# Altium project SAMC21N_Xplained_Pro.PrjPCB (part 2 of 3)

## Sheet SAMC21N_Xplained_Pro_dual_input_power_supply.SchDoc: Power supply
size A3; Organization: Microchip India; DocumentNumber: A09-2682; Revision: 4; SheetNumber: 2; SheetTotal: 9; CheckedBy: M.S.K; DrawnBy: Microchip India; PageSetup: Record=PageOptions|CenterHorizontal=True|CenterVertical=True|PrintScale=0.71|XCorrection=1.00|YCorrection=1.00|PrintKind=0|BorderSize=5000000|LeftOffset=0|BottomOffset=0|Orientation=2|PaperLength=1000|PaperWidth=1000|Scale=100|PaperSource=15|PrintQuality=600|MediaType=1|DitherType=10|PrintScaleMode=1|PaperKind=A4 (210 x 297 mm)|PaperIndex=9; PCBNumber: A08-2581; PCBRevision: 2; ProjectTitle: ATSAMC21N-XPRO
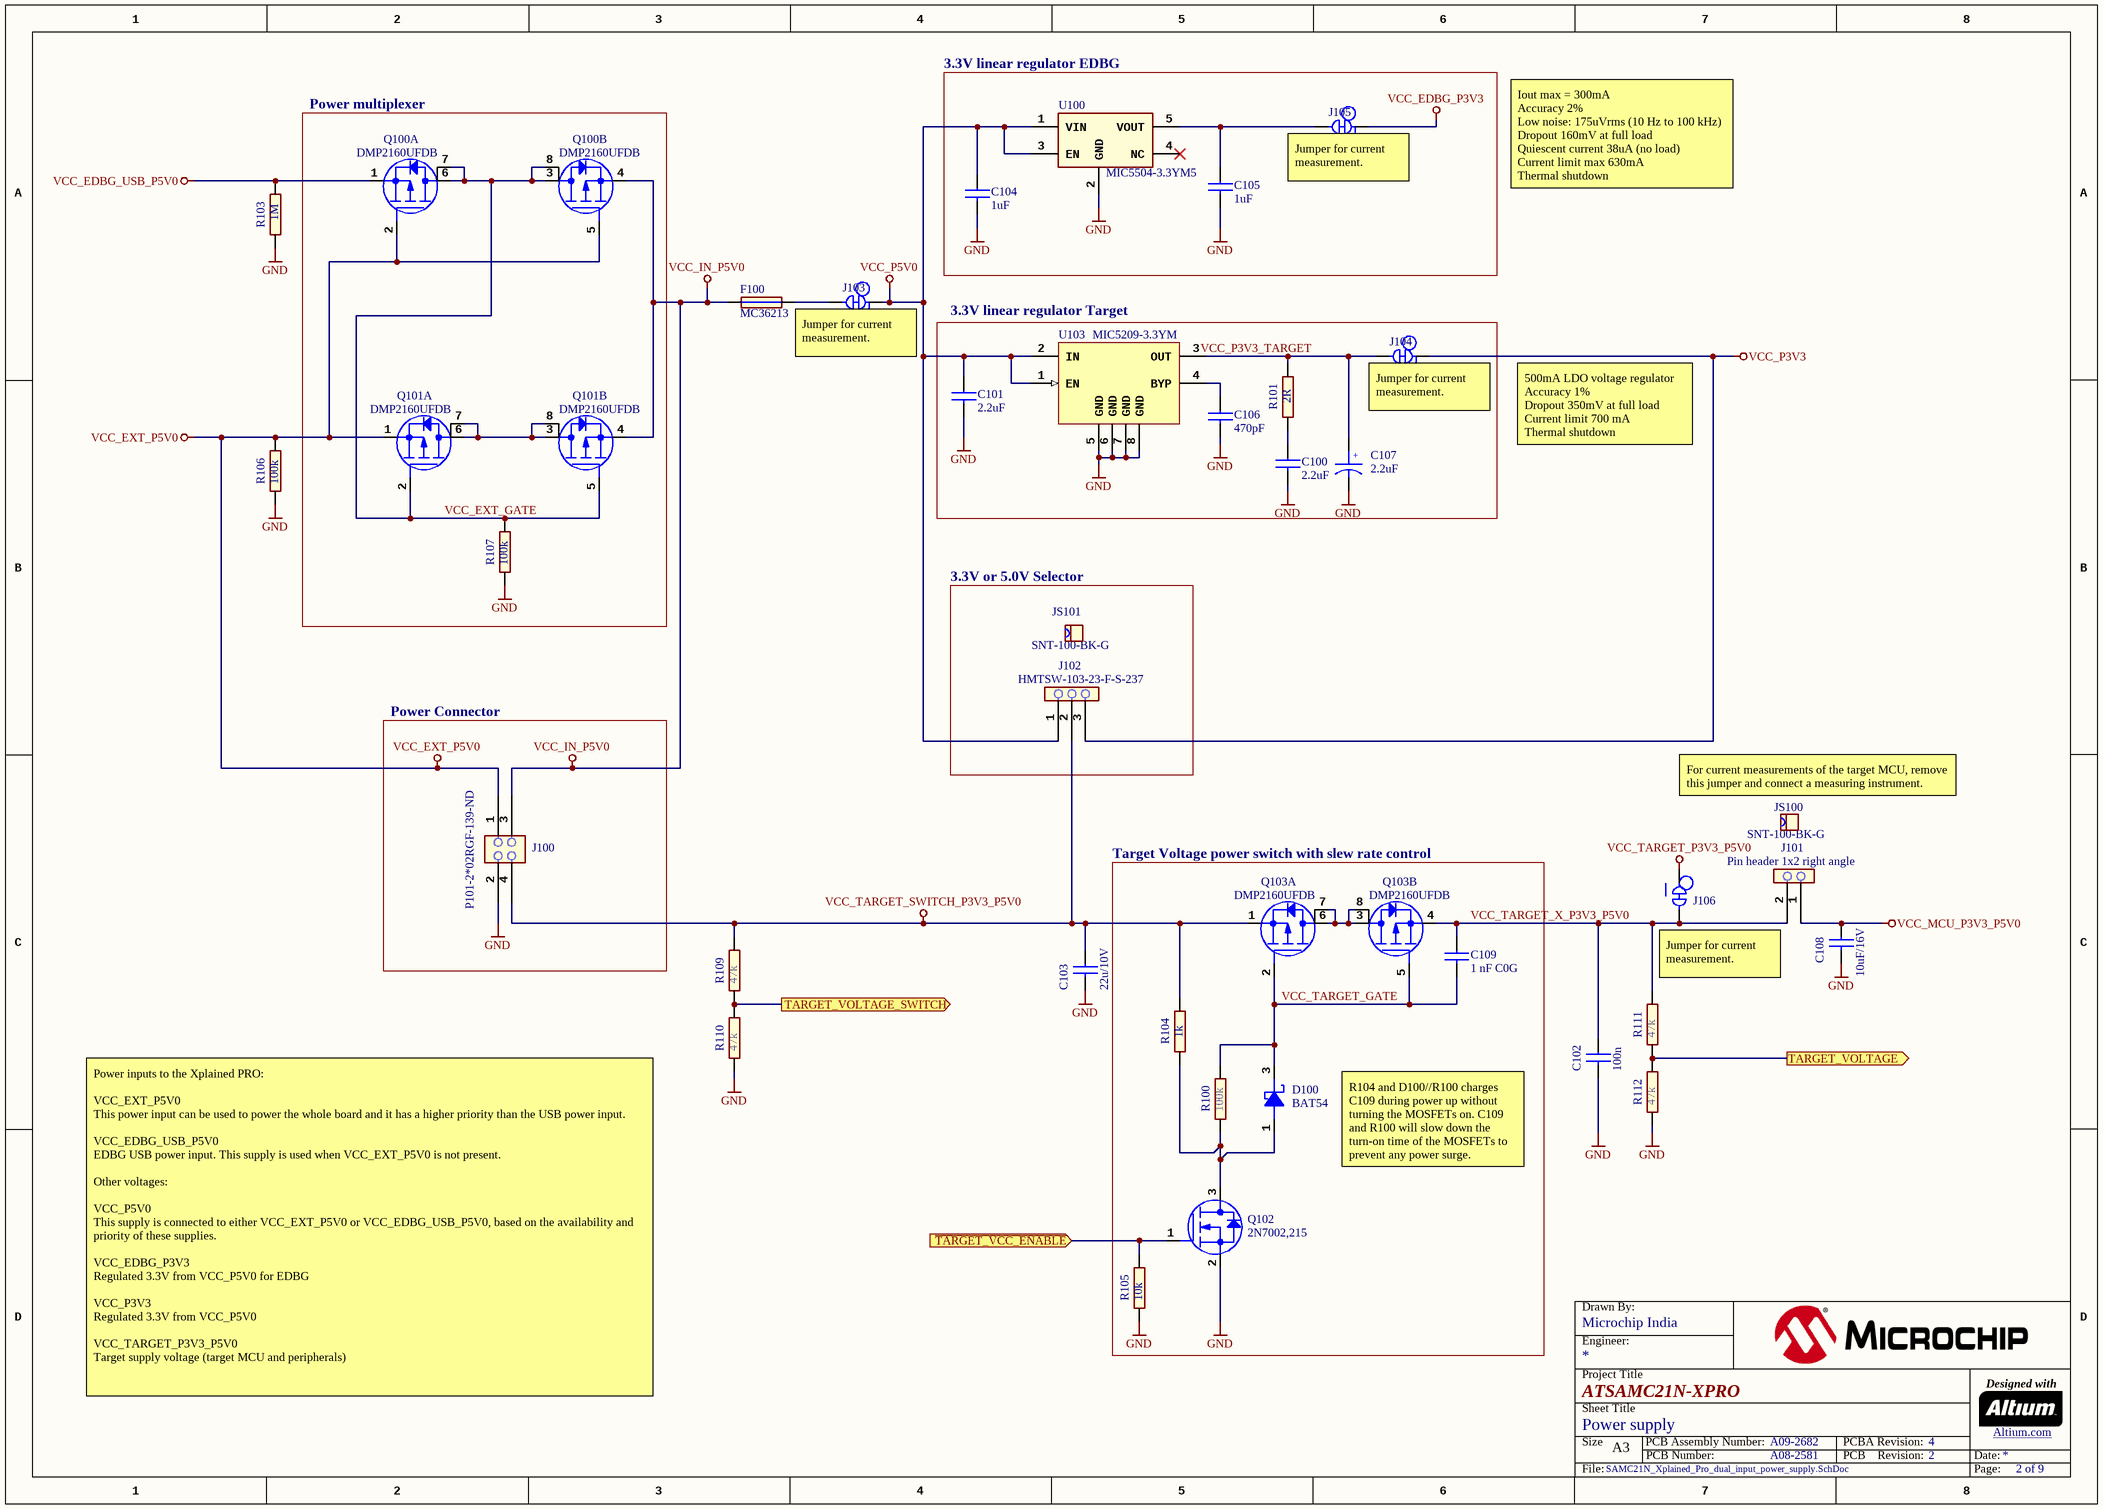
[diagram p4: SAMC21N_Xplained_Pro_dual_input_power_supply.SchDoc]

### Parts
C100  value 2.2uF  [AP1-00096]  (hidden comment: CAP-NONPOL)
C101  value 2.2uF  [AP1-00096]  (hidden comment: CAP-NONPOL)
C102  value 100n  [AP1-00001]  (hidden comment: CAP-NONPOL)
C103  value 22u/10V  [AP1-00003]  (hidden comment: CAP-NONPOL)
C104  value 1uF  [AP1-00001]  (hidden comment: 490-3890-2-ND@digikey)
C105  value 1uF  [AP1-00001]  (hidden comment: 490-3890-2-ND@digikey)
C106  value 470pF  [AP1-00001]  (hidden comment: CAP-NONPOL)
C107  value 2.2uF  [AP1-00036]  (hidden comment: CAP-POL)
C108  value 10uF/16V  [AP1-00039]  (hidden comment: CAP-NONPOL)
C109  1 nF C0G  [AP1-00053]
D100  value BAT54  [AP4-00007]  (hidden comment: SCHOTTKY_SMD_31)
F100  value MC36213  [AP2-00002]  (hidden comment: Farnell no: 1861197)
J100  value P101-2*02RGF-139-ND  [AP8-00628]  (hidden comment: HEADER 2x2)
J101  value Pin header 1x2 right angle  [AP8-00367]  (hidden comment: HEADER 1x2)
J102  value HMTSW-103-23-F-S-237  [AP8-00745]  (hidden comment: Same as A08-1614 but with 1mm hole for optimal reflow soldering (no misalignment of the component))
J103  SMD-STRAP_CLOSED  [AP9-00044]  (value not drawn)  (net tie, no BOM)
J104  SMD-STRAP_CLOSED  [AP9-00044]  (value not drawn)  (net tie, no BOM)
J105  SMD-STRAP_CLOSED  [AP9-00044]  (value not drawn)  (net tie, no BOM)
J106  SMD-STRAP_CLOSED  [AP9-00044]  (value not drawn)  (net tie, no BOM)
JS100  value SNT-100-BK-G  [AP8-00525]  (hidden comment: To be used by request from ESCATEC)
JS101  value SNT-100-BK-G  [AP8-00525]  (hidden comment: To be used by request from ESCATEC)
Q100  value DMP2160UFDB  [AP5-00047]  (hidden comment: MOSFET_DUAL_P_S1G1D2S2G2D1D1D2)  (parts A,B of 2)
Q101  value DMP2160UFDB  [AP5-00047]  (hidden comment: MOSFET_DUAL_P_S1G1D2S2G2D1D1D2)  (parts A,B of 2)
Q102  value 2N7002,215  [AP5-00002]  (hidden comment: MOSFET_N_GSD)
Q103  value DMP2160UFDB  [AP5-00047]  (hidden comment: MOSFET_DUAL_P_S1G1D2S2G2D1D1D2)  (parts A,B of 2)
R100  value 100k  [AP2-00000]  (hidden comment: R2)
R101  value 2R  [AP2-00000]  (hidden comment: R2)
R103  value 1M  [AP2-00000]  (hidden comment: R2)
R104  value 1k  [AP2-00000]  (hidden comment: R2)
R105  value 10k  [AP2-00000]  (hidden comment: R2)
R106  value 100k  [AP2-00000]  (hidden comment: R2)
R107  value 100k  [AP2-00000]  (hidden comment: R2)
R109  value 47k  [AP2-00000]  (hidden comment: R2)
R110  value 47k  [AP2-00000]  (hidden comment: R2)
R111  value 47k  [AP2-00000]  (hidden comment: R2)
R112  value 47k  [AP2-00000]  (hidden comment: R2)
U100  value MIC5504-3.3YM5  [AP6-00087]  (hidden comment: MIC5504)
U103  MIC5209-3.3YM  [AP6-00000]

### Blocks framed on the sheet
Power multiplexer: Q100 Q101 R107
3.3V linear regulator EDBG: C104 C105 J105 U100
3.3V linear regulator Target: C100 C101 C106 C107 J104 R101 U103
3.3V or 5.0V Selector: J102 JS101
Power Connector: J100
Target Voltage power switch with slew rate control: C109 D100 Q102 Q103 R100 R104 R105

### Ports
TARGET_VOLTAGE (out), TARGET_VOLTAGE_SWITCH (out), ~{TARGET_VCC_ENABLE} (in)

### Nets
GND: C100.2 C101.2 C102.2 C103.2 C104.2 C105.2 C106.2 C107.2 C108.2 J100.2 Q102.2(S) R103.1 R105.1 R106.1 R107.1 R110.1 R112.1 U100.2(GND) U103.5(GND) U103.6(GND) U103.7(GND) U103.8(GND)
VCC_EDBG_P3V3: J105.1
VCC_EDBG_USB_P5V0: Q100.1(S1) R103.2
VCC_EXT_P5V0: J100.1 Q100.2(G1) Q100.5(G2) Q101.1(S1) R106.2
VCC_IN_P5V0: F100.1 J100.3 Q100.4(S2) Q101.4(S2)
VCC_MCU_P3V3_P5V0: C108.1 J101.1
VCC_P3V3: J102.3 J104.1
VCC_P5V0: C101.1 C104.1 J102.1 J103.1 U100.1(VIN) U100.3(EN) U103.1(EN) U103.2(IN)
VCC_TARGET_P3V3_P5V0: J106.1
VCC_TARGET_SWITCH_P3V3_P5V0: C103.1 J100.4 J102.2 Q103.1(S1) R104.2 R109.2
EDBG_ADC0: R111.1 R112.2 ; port TARGET_VOLTAGE
EDBG_ADC1: R109.1 R110.2 ; port TARGET_VOLTAGE_SWITCH
~{TARGET_VCC_ENABLE}: Q102.1(G) R105.2 ; port ~{TARGET_VCC_ENABLE}
VCC_EXT_GATE: Q100.3(D2) Q100.6(D1) Q100.7(D1_PAD) Q100.8(D2_PAD) Q101.2(G1) Q101.5(G2) R107.2
VCC_TARGET_GATE: C109.2 D100.3(CATHODE) Q103.2(G1) Q103.5(G2) R100.2
VCC_TARGET_X_P3V3_P5V0: C102.1 C109.1 J101.2 J106.2 Q103.4(S2) R111.2
NetC100_1: C100.1 R101.1
NetC105_1: C105.1 J105.2 U100.5(VOUT)
NetC106_1: C106.1 U103.4(BYP)
NetC107_1: C107.1 J104.2 R101.2 U103.3(OUT)
NetD100_1: D100.1(ANODE) Q102.3(D) R100.1 R104.1
NetF100_2: F100.2 J103.2
NetQ101_3: Q101.3(D2) Q101.6(D1) Q101.7(D1_PAD) Q101.8(D2_PAD)
NetQ103_3: Q103.3(D2) Q103.6(D1) Q103.7(D1_PAD) Q103.8(D2_PAD)

Not connected (* = marked no-connect by the designer): U100 4(NC)*

### Notes on the sheet
- (near J105) Jumper for current measurement.
- Iout max = 300mA
  Accuracy 2%
  Low noise: 175uVrms (10 Hz to 100 kHz)
  Dropout 160mV at full load
  Quiescent current 38uA (no load)
  Current limit max 630mA
  Thermal shutdown
- (near J103) Jumper for current measurement.
- (near J104) Jumper for current measurement.
- 500mA LDO voltage regulator
  Accuracy 1%
  Dropout 350mV at full load
  Current limit 700 mA
  Thermal shutdown
- (near JS100) For current measurements of the target MCU, remove this jumper and connect a measuring instrument.
- Jumper for current measurement.
- R104 and D100//R100 charges C109 during power up without turning the MOSFETs on. C109 and R100 will slow down the turn-on time of the MOSFETs to prevent any power surge.
- Power inputs to the Xplained PRO:
  VCC_EXT_P5V0
  This power input can be used to power the whole board and it has a higher priority than the USB power input.
  VCC_EDBG_USB_P5V0
  EDBG USB power input. This supply is used when VCC_EXT_P5V0 is not present.
  Other voltages:
  VCC_P5V0
  This supply is connected to either VCC_EXT_P5V0 or VCC_EDBG_USB_P5V0, based on the availability and priority of these supplies.
  VCC_EDBG_P3V3
  Regulated 3.3V from VCC_P5V0 for EDBG
  VCC_P3V3
  Regulated 3.3V from VCC_P5V0
  VCC_TARGET_P3V3_P5V0
  Target supply voltage (target MCU and peripherals)
- Labels drawn without touching a wire or pin: VCC_P3V3_TARGET
- Drawn By:
- Project Title
- Engineer:
- Designed with
- Sheet Title
- Size
- A3
- PCB Number:
- PCB Assembly Number:
- PCBA Revision:
- PCB    Revision:
- Date:
- Altium.com <http://go.altium.com/MicrochipLandingPage_Evaluation.html>
- File:
- Page:
- (in symbol A01-0492) +

### Library data of the parts
C100 C101 = A01-0691: Ceramic capacitor, SMD 0603, X7R, 10V, 10%; PartGroup: Capacitors,Ceramic,SMD 0603; Manufacturer: Murata; MPN: GRM188R71A225KE15D; TemperatureRange: -55 to +125 deg C; ComponentStatus: 'Active (verified)'; Status: Active; Verified by: Lars Helge Mo; Verified date: 2005-12-15; AN: A01-0691; Tolerance: 10%; Height: 0.800000011920929; FootprintStatus: 'Active (Verified)'
C102 = A01-0246: Ceramic capacitor, SMD 0402, X7R, 16V, +/-10%; PartGroup: Capacitors,Ceramic,SMD 0402; Manufacturer: Kemet; MPN: C0402C104K4RACTU; TemperatureRange: -55 - +125 deg C; ComponentStatus: 'Active (verified)'; Status: Active; Verified by: Lars Helge Mo; Verified date: 2005-12-15; AN: A01-0246; Tolerance: 16V, +/-10%; Height: 0,5; FootprintStatus: 'Active (Verified)'
C103 = A01-0500: Ceramic capacitor, SMD 0805, X5R, 10V, Â±20%; PartGroup: Capacitors,Ceramic,SMD 0805; Manufacturer: tdk; MPN: C2012X5R1A226M/0.85; TemperatureRange: -55Â°C to +85Â°C; ComponentStatus: 'Active (verified)'; Status: Active; Verified by: Lars Helge Mo; Verified date: 2005-12-15; AN: A01-0500; Height: 0.949999988079071; FootprintStatus: 'Active (Verified)'
C104 C105 = A01-0618: Ceramic capacitor, SMD 0402, X5R, 10V, 10%; PartGroup: Capacitors,Ceramic,SMD 0402; Manufacturer: Murata; MPN: GRM155R61A105KE15D; TemperatureRange: -55 to +85 deg C; ComponentStatus: 'Active (verified)'; Status: Active; Verified by: Lars Helge Mo; Verified date: 2005-12-15; AN: A01-0618; Tolerance: 10%; Height: 0.550000011920929; FootprintStatus: 'Active (Verified)'
C106 = A01-0322: Ceramic capacitor, SMD 0402, NP0, 50V, +/-5%; PartGroup: Capacitors,Ceramic,SMD 0402; Manufacturer: Murata; MPN: GRM1555C1H471JA01D; TemperatureRange: -55 - +125 deg C; ComponentStatus: 'Active (verified)'; Status: Active; Verified by: Lars Helge Mo; Verified date: 2005-12-15; AN: A01-0322; Tolerance: 50V, +/-5%; Height: 0.5; FootprintStatus: 'Active (Verified)'
C107 = A01-0492: Capacitor Tantalum 10V 2.2uF 10% ESR = 6 ohm; PartGroup: Capacitors,Tantalum; Manufacturer: Kemet; MPN: T494A225K010AT; TemperatureRange: - 55 C to + 125 C; ComponentStatus: 'Active (verified)'; Status: Active; Verified date: 2006-02-03; Verified by: Ketil Skjerve; AN: A01-0492; Tolerance: ±10%; Height: 1.79999995231628; FootprintStatus: 'Active (Verified)'
C108 = A01-0491: Ceramic capacitor, SMD 0603, X5R, 16V, 10UF ± 20% (High Density); PartGroup: Capacitors,Ceramic,SMD 0603; Manufacturer: Taiyo Yuden; MPN: EMK107BBJ106MA-T; Tolerance: ­± 20%; TemperatureRange: -55°C to +85°C; ComponentStatus: 'Active (verified)'; Status: Active; Verified by: Lars Helge Mo; Verified date: 2005-12-15; AN: A01-0491; Height: 0,819999992847443; FootprintStatus: 'Active (Verified)'
C109 = A01-0321: Ceramic capacitor, SMD 0402, C0G, 50V, +/-5%; PartGroup: Capacitors,Ceramic,SMD 0402; Manufacturer: Murata; MPN: GRM1555C1H102JA01D; Tolerance: 5%; ComponentStatus: 'Active (verified)'; Status: Active; Verified by: Lars Helge Mo; Verified date: 2005-12-15; AN: A01-0321; Value: 1 nF C0G; FootprintStatus: 'Active (Verified)'
D100 = A04-0001: Schottky diode, V(rrm)=30V, I(f)=0.1A, V(f)=0.4V (at If = 0.01A), I(r)=0.5uA (at Vrrm), t(rr)=5ns, SMD SOT23; PartGroup: Diodes,Schottky; Manufacturer: Philips; NC: 2; TemperatureRange: -40 - +85 deg C; ComponentStatus: 'Active (verified)'; Status: Active; Verified by: Ketil Skjerve; Verified date: 2006-06-28; AN: A04-0001; Height: 1,10000002384186; MPN: BAT54; FootprintStatus: 'Active (Verified)'
F100 = A02-0622: Resetable PTC fuse, Ih = 0.5A, It = 1.0A, 0805 package; PartGroup: Resistors,Resettable fuses,SMD; Manufacturer: Multicomp; TemperatureRange: -40°C to + 85°C; ComponentStatus: 'Active (verified)'; Verified date: 2006-01-30; Verified by: Ketil Skjerve; Status: Active; AN: A02-0622; Height: 1.25; MPN: MC36213; FootprintStatus: 'Active (Verified)'
J100 = A08-1519: Pin header, 2x2, Right Angle, 2.54mm, THT, Pin In Paste; PartGroup: Mechanical devices,Connectors,Pin headers; ComponentStatus: 'New (not verified)'; Verified date: 2005-12-19; Verified by: Lars Helge Mo; Status: Active; AN: A08-1519; Height: 5.07999992370605; MPN: P101-2*02RGF-139-ND; FootprintStatus: 'New (Not verified)'
J101 = A08-0764: 1x2 pin header, right angle, 2.54 mm pitch, through-hole; PartGroup: Mechanical devices,Connectors,Pin headers; Manufacturer: Pro-data International Corp; MPN: 2213R-2G; ComponentStatus: 'Active (verified)'; Verified date: 2006-01-30; Verified by: Lars Helge; Status: Active; AN: A08-0764; Height: 2.53999996185303; FootprintStatus: 'Active (Verified)'
J102 = A08-1799: 1x3 pin header, 2.54mm pitch, Pin-in-Paste THM, 1mm hole; PartGroup: Mechanical devices,Connectors,Pin headers; Manufacturer: SAMTEC; ComponentStatus: 'Active (verified)'; Verified date: 2006-01-30; Verified by: Lars Helge Mo; Status: Active; AN: A08-1799; Height: 6.09999990463257; MPN: HMTSW-103-23-F-S-237; FootprintStatus: 'New (Not verified)'
J103-J106 = A09-0783: Default closed SMD strap, 0603 size; PartGroup: Mechanical devices,PCB implemented components; Value: SMD-STRAP_0603_CLOSED; ComponentStatus: 'Active (verified)'; AN: A09-0783; Height: 0; FootprintStatus: 'Active (Verified)'
JS100 JS101 = A08-0543: Jumper cap for 2.54mm pinheader; PartGroup: Mechanical devices,Mounting accessories,Other; Manufacturer: SAMTEC; ComponentStatus: 'Active (verified)'; Verified date: 2006-04-05; Verified by: Lars Helge Mo; Status: Active; AN: A08-0543; MPN: SNT-100-BK-G; FootprintStatus: 'Active (Verified)'
Q100 Q101 Q103 = A05-0171: MOSFET 20V 3.8A DUAL P-CHAN, Rds 70 mOhms, Vgs 12V, Vds -20; PartGroup: Transistors,Power FET,SMD; Manufacturer: Diodes Incorporated; MPN: DMP2160UFDB-7; TemperatureRange: -55 C to +150 C; ComponentStatus: 'Active (verified)'; AN: A05-0171; Height: 0.605000019073486; FootprintStatus: 'Active (Verified)'
Q102 = A05-0085: N-Channel MOSFET. 60V, 0.300A continuous, 1.2A Peak. RDS(ON) = 3.8Ohm@VGS=4.5V, VGS(th)<2.5V; PartGroup: Transistors,Small signal FET,SMD; Manufacturer: NXP; TemperatureRange: -65 to 150 deg C; ComponentStatus: 'Active (verified)'; Status: New; AN: A05-0085; Height: 1.10000002384186; MPN: 2N7002,215; FootprintStatus: 'Active (Verified)'
R100 = A02-0260: Thick film resistor, SMD 0402, 1/16W, 1%; PartGroup: Resistors,SMD,0402 1%; TemperatureRange: -55ï¿½ to +125ï¿½C; ComponentStatus: 'Active (verified)'; Status: Active; Verified by: Lars Helge Mo; Verified date: 2005-12-19; AN: A02-0260; Tolerance: 1 %; Height: 0,349999994039536; FootprintStatus: 'Active (Verified)'
R101 = A02-1147: RES SMD 2 OHM 1% 1/16W 0402; Status: Active; Verified by: Lars Helge Mo; Verified date: 2005-12-19; AN: A02-1147
R103 = A02-0284: Thick film resistor, SMD 0402, 1/16W, 1%; PartGroup: Resistors,SMD,0402 1%; TemperatureRange: -55 - +125 deg C; ComponentStatus: 'Active (verified)'; Status: Active; Verified by: Lars Helge Mo; Verified date: 2005-12-19; AN: A02-0284; Tolerance: 1 %; Height: 0.349999994039536; FootprintStatus: 'Active (Verified)'
R104 = A02-0212: Thick film resistor, SMD 0402, 1/16W, 1%; PartGroup: Resistors,SMD,0402 1%; TemperatureRange: -55 - +125 deg C; ComponentStatus: 'Active (verified)'; Status: Active; Verified by: Lars Helge Mo; Verified date: 2005-12-19; AN: A02-0212; Tolerance: 1 %; Height: 0,349999994039536; FootprintStatus: 'Active (Verified)'
R105 = A02-0236: Thick film resistor, SMD 0402, 1/16W, 1%; PartGroup: Resistors,SMD,0402 1%; Manufacturer: vishay; MPN: CRCW040210K0FKED; TemperatureRange: -55 - +125 deg C; ComponentStatus: 'Active (verified)'; Status: Active; Verified by: Lars Helge Mo; Verified date: 2005-12-19; AN: A02-0236; Tolerance: 1 %; Height: 0,349999994039536; FootprintStatus: 'Active (Verified)'
R106 R107 = A02-0260: Thick film resistor, SMD 0402, 1/16W, 1%; PartGroup: Resistors,SMD,0402 1%; TemperatureRange: -55 - +125 deg C; ComponentStatus: 'Active (verified)'; Status: Active; Verified by: Lars Helge Mo; Verified date: 2005-12-19; AN: A02-0260; Tolerance: 1 %; Height: 0.349999994039536; FootprintStatus: 'Active (Verified)'
R109-R112 = A02-0252: Thick film resistor, SMD 0402, 1/16W, 1%; PartGroup: Resistors,SMD,0402 1%; TemperatureRange: -55 - +125 deg C; ComponentStatus: 'Active (verified)'; Status: Active; Verified by: Lars Helge Mo; Verified date: 2005-12-19; AN: A02-0252; Tolerance: 1 %; Height: 0.349999994039536; FootprintStatus: 'Active (Verified)'
U100 = A06-1476: LDO 3.3V 0.3A SOT-23-5; PartGroup: Integrated Circuits,Regulators,Linear; Manufacturer: Microchip; MPN: MIC5504-3.3YM5-TR; TemperatureRange: -40Â°C ~ 125Â°C; ComponentStatus: 'Active (verified)'; AN: A06-1476; Design Comment: *; Verified by: *; Verified date: *; Height: 1.45000004768372; FootprintStatus: 'Active (Verified)'
U103 = A06-1496: Fixed 3.3V, 500mA Low-Noise LDO Regulator, SOIC-8; PartGroup: Integrated Circuits,Regulators,Linear; Manufacturer: Microchip; TemperatureRange: -40Â°C ~ 125Â°C; ComponentStatus: 'Active (verified)'; Status: New; Value: MIC5209-3.3YM; AN: A06-1496; Height: 1.62999999523163; MPN: MIC5209-3.3YM; FootprintStatus: 'Active (Verified)'

## Sheet SAMC21N_Xplained_Pro_CAN_LIN.SchDoc: CAN & LIN Interface
size A3; Organization: Microchip India; DocumentNumber: A09-2682; Revision: 4; SheetNumber: 6; SheetTotal: 9; CheckedBy: M.S.K; DrawnBy: Microchip India; PageSetup: Record=PageOptions|CenterHorizontal=True|CenterVertical=True|PrintScale=1.01|XCorrection=1.00|YCorrection=1.00|PrintKind=1|BorderSize=5000000|LeftOffset=0|BottomOffset=0|Orientation=2|PaperLength=1000|PaperWidth=1000|Scale=100|PaperSource=7|PrintQuality=-4|MediaType=1|DitherType=10|PaperKind=A3 (297 x 420 mm)|PrintScaleMode=1; ProjectTitle: ATSAMC21N-XPRO; PCBNumber: A08-2581; PCBRevision: 2; ProjectName: SAM C21 Xplained Pro
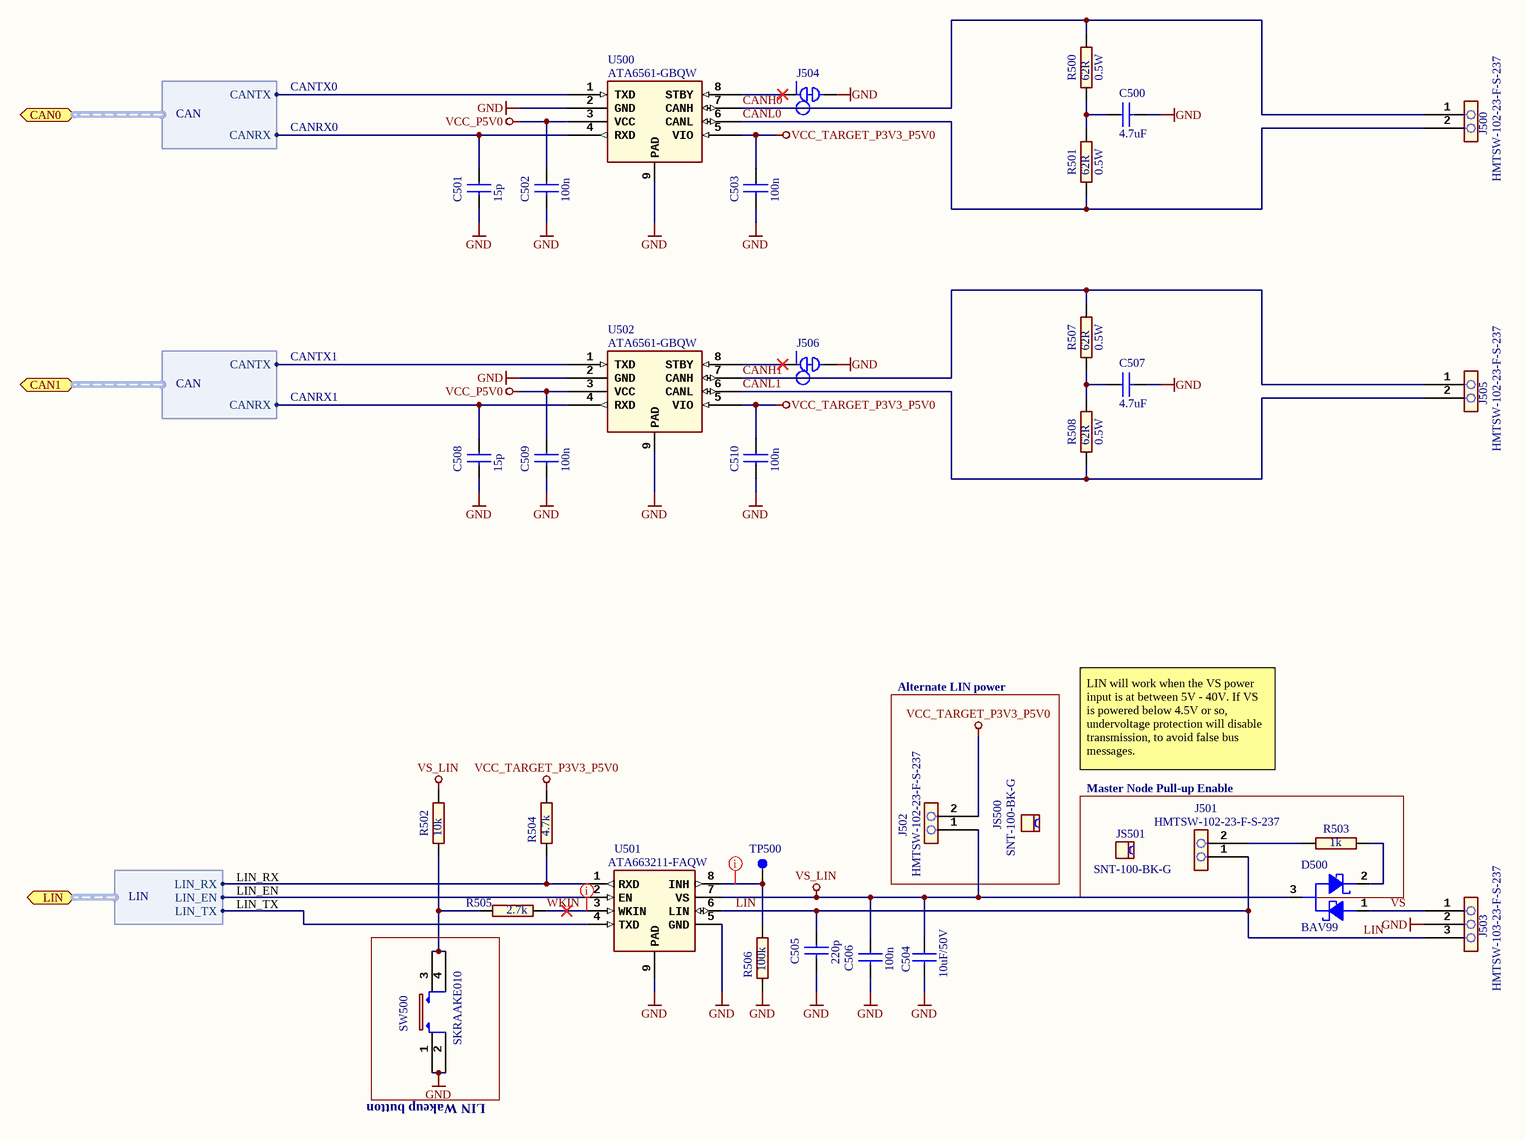
[diagram p5: SAMC21N_Xplained_Pro_CAN_LIN.SchDoc]

### Parts
C500  value 4.7uF  [AP1-00003]  (hidden comment: CAP-NONPOL)
C501  value 15p  [AP1-00001]  (hidden comment: CAP-NONPOL)
C502  value 100n  [AP1-00001]  (hidden comment: CAP-NONPOL)
C503  value 100n  [AP1-00001]  (hidden comment: CAP-NONPOL)
C504  value 10uF/50V  [AP1-00015]  (hidden comment: CAP-NONPOL)
C505  value 220p  [AP1-00001]  (hidden comment: CAP-NONPOL)
C506  value 100n  [AP1-00001]  (hidden comment: CAP-NONPOL)
C507  value 4.7uF  [AP1-00003]  (hidden comment: CAP-NONPOL)
C508  value 15p  [AP1-00001]  (hidden comment: CAP-NONPOL)
C509  value 100n  [AP1-00001]  (hidden comment: CAP-NONPOL)
C510  value 100n  [AP1-00001]  (hidden comment: CAP-NONPOL)
D500  value BAV99  [AP4-00018]  (hidden comment: DUAL_SCHOTTKY_132)
J500  value HMTSW-102-23-F-S-237  [AP8-00733]  (hidden comment: HEADER 1x2)
J501  value HMTSW-102-23-F-S-237  [AP8-00733]  (hidden comment: HEADER 1x2)
J502  value HMTSW-102-23-F-S-237  [AP8-00733]  (hidden comment: HEADER 1x2)
J503  value HMTSW-103-23-F-S-237  [AP8-00745]  (hidden comment: Same as A08-1614 but with 1mm hole for optimal reflow soldering (no misalignment of the component))
J504  (no value)  [AP9-00044]  (net tie, no BOM)
J505  value HMTSW-102-23-F-S-237  [AP8-00733]  (hidden comment: HEADER 1x2)
J506  (no value)  [AP9-00044]  (net tie, no BOM)
JS500  value SNT-100-BK-G  [AP8-00525]  (hidden comment: To be used by request from ESCATEC)
JS501  value SNT-100-BK-G  [AP8-00525]  (hidden comment: To be used by request from ESCATEC)
R500  0.5W  value 62R  [AP2-00008]
R501  0.5W  value 62R  [AP2-00008]
R502  value 10k  [AP2-00000]  (hidden comment: R2)
R503  value 1k  [AP2-00000]  (hidden comment: R2)
R504  value 4.7k  [AP2-00000]  (hidden comment: R2)
R505  value 2.7k  [AP2-00000]  (hidden comment: R2)
R506  value 100k  [AP2-00000]  (hidden comment: R2)
R507  0.5W  value 62R  [AP2-00008]
R508  0.5W  value 62R  [AP2-00008]
SW500  value SKRAAKE010  [AP8-00137]  (hidden comment: Can be ordered in low volumes from Mouser)
TP500  TESTPOINT  [AP8-00010]  (value not drawn)  (no BOM)
U500  value ATA6561-GBQW  [AP6-00407]  (hidden comment: ATA6561)
U501  value ATA663211-FAQW  [AP6-00407]  (hidden comment: ATA663211)
U502  value ATA6561-GBQW  [AP6-00407]  (hidden comment: ATA6561)

### Blocks framed on the sheet
Alternate LIN power: J502 JS500
Master Node Pull-up Enable: D500 J501 JS501 R503
LIN Wakeup button: SW500

### Ports
CAN0 (harness CAN), CAN1 (harness CAN), LIN (harness LIN)

### Harnesses
CAN: CANTX, CANRX
LIN: LIN_RX, LIN_EN, LIN_TX

### Nets
GND: C500.2 C501.2 C502.2 C503.2 C504.2 C505.2 C506.2 C507.2 C508.2 C509.2 C510.2 J503.2 J504.2 J506.2 R506.1 SW500.1 SW500.2 U500.2(GND) U500.9(PAD) U501.5(GND) U501.9(PAD) U502.2(GND) U502.9(PAD)
VCC_P5V0: C502.1 C509.1 U500.3(VCC) U502.3(VCC)
VCC_TARGET_P3V3_P5V0: C503.1 C510.1 J502.2 R504.2 U500.5(VIO) U502.5(VIO)
VS_LIN: C504.1 C506.1 D500.3(ANODE_CATHODE) J502.1 R502.2 U501.7(VS)
CANH0: J500.1 R500.2 U500.7(CANH)
CANH1: J505.1 R507.2 U502.7(CANH)
CANL0: J500.2 R501.1 U500.6(CANL)
CANL1: J505.2 R508.1 U502.6(CANL)
LIN: C505.1 J501.1 J503.3 U501.6(LIN)
PA06_S0_LIN_TX: U501.4(TXD) ; port LIN.LIN_TX
PA07_S0_LIN_RX: R504.1 U501.1(RXD) ; port LIN.LIN_RX
PA24_CAN0_TX: U500.1(TXD) ; port CAN0.CANTX
PA25_CAN0_RX: C501.1 U500.4(RXD) ; port CAN0.CANRX
PB14_CAN1_TX: U502.1(TXD) ; port CAN1.CANTX
PB15_CAN1_RX: C508.1 U502.4(RXD) ; port CAN1.CANRX
PC15_GPIO_LIN_EN: U501.2(EN) ; port LIN.LIN_EN
VS: D500.1(ANODE) J503.1
WKIN: R505.2 U501.3(WKIN)
NetC500_1: C500.1 R500.1 R501.2
NetC507_1: C507.1 R507.1 R508.2
NetD500_2: D500.2(CATHODE) R503.2
NetJ501_2: J501.2 R503.1
NetJ504_1: J504.1 U500.8(STBY)
NetJ506_1: J506.1 U502.8(STBY)
NetR502_1: R502.1 R505.1 SW500.3 SW500.4
NetR506_2: R506.2 TP500.1 U501.8(INH)

### Layout directives
rule Assembly Testpoint Usage [Testpoint - Not Allowed    Multiple - Not Allowed]: NetR506_2, WKIN

### Notes on the sheet
- CANTX0
- CANRX0
- CANTX1
- CANRX1
- LIN will work when the VS power input is at between 5V - 40V. If VS is powered below 4.5V or so, undervoltage protection will disable transmission, to avoid false bus messages.
- LIN_RX
- LIN_TX
- LIN_EN
- Drawn By:
- Project Title
- Engineer:
- Designed with
- Sheet Title
- Size
- A3
- PCB Number:
- PCB Assembly Number:
- PCBA Revision:
- PCB    Revision:
- Date:
- Altium.com <http://go.altium.com/MicrochipLandingPage_Evaluation.html>
- File:
- Page:

### Library data of the parts
C500 C507 = A01-0400: Ceramic capacitor, SMD 0805, X5R, 25V, ±10 %; PartGroup: Capacitors,Ceramic,SMD 0805; Manufacturer: Murata; MPN: GRM21BR61E475KA12L; Tolerance: ±10%; ComponentStatus: 'Active (verified)'; Status: Active; Verified by: Lars Helge Mo; Verified date: 2005-12-15; AN: A01-0400; Height: 1,25; FootprintStatus: 'Active (Verified)'
C501 C508 = A01-0017: Ceramic capacitor, SMD 0402, NP0, 50V, +/-5%; PartGroup: Capacitors,Ceramic,SMD 0402; TemperatureRange: -55 - +125 deg C; ComponentStatus: 'Active (verified)'; Status: Active; Verified by: Lars Helge Mo; Verified date: 2005-12-15; AN: A01-0017; Tolerance: 50V, +/-5%; Height: 0,550000011920929; FootprintStatus: 'Active (Verified)'
C502 C503 C506 C509 C510 = A01-0246: as C102 on sheet SAMC21N_Xplained_Pro_dual_input_power_supply; Status: Active; Verified by: Lars Helge Mo; Verified date: 2005-12-15; AN: A01-0246; Tolerance: 16V, +/-10%; Height: 0,5; FootprintStatus: 'Active (Verified)'
C504 = A01-0586: Ceramic capacitor, SMD 1210, X7S , 50V, Â±10%; PartGroup: Capacitors,Ceramic,SMD 1210; Manufacturer: tdk; MPN: CGA6P3X7S1H106K; TemperatureRange: -55 - +125 deg C; ComponentStatus: 'Active (verified)'; Status: Active; Verified by: Lars Helge Mo; Verified date: 2005-12-15; AN: A01-0586; Tolerance: 50V, Â±10%; Height: 2.5; FootprintStatus: 'Active (Verified)'
C505 = A01-0030: Ceramic capacitor, SMD 0402, X7R, 50V, +/-10%; PartGroup: Capacitors,Ceramic,SMD 0402; TemperatureRange: -55 - +125 deg C; ComponentStatus: 'Active (verified)'; Status: Active; Verified by: Lars Helge Mo; Verified date: 2005-12-15; AN: A01-0030; Tolerance: 50V, +/-10%; Height: 0.550000011920929; FootprintStatus: 'Active (Verified)'
D500 = A04-0011: High-speed Double Diode; PartGroup: Diodes,Schottky; Manufacturer: Philips; ComponentStatus: 'Active (verified)'; Verified date: 2006-02-07; Verified by: Ketil Skjerve; Status: Active; AN: A04-0011; Height: 1.10000002384186; MPN: BAV99; FootprintStatus: 'Active (Verified)'
J500-J502 J505 = A08-1754: 1x2 pin header, 2.54mm pitch, Pin-in-Paste THM; PartGroup: Mechanical devices,Connectors,Pin headers; Manufacturer: SAMTEC; TemperatureRange: - 55 deg C to + 125 deg C; ComponentStatus: 'Active (verified)'; Verified date: 2006-01-30; Verified by: Lars Helge; Status: Active; AN: A08-1754; MPN: HMTSW-102-23-F-S-237; FootprintStatus: 'Active (Verified)'
  J500 J505: Height: 6,09999990463257
  J501 J502: Height: 6.09999990463257
J503 = A08-1799: as J102 on sheet SAMC21N_Xplained_Pro_dual_input_power_supply; Verified date: 2006-01-30; Verified by: Lars Helge Mo; Status: Active; AN: A08-1799; Height: 6.09999990463257; MPN: HMTSW-103-23-F-S-237; FootprintStatus: 'New (Not verified)'
J504 J506 = A09-0783: as J103-J106 on sheet SAMC21N_Xplained_Pro_dual_input_power_supply; AN: A09-0783; Height: 0; FootprintStatus: 'Active (Verified)'
JS500 JS501 = A08-0543: as JS100 on sheet SAMC21N_Xplained_Pro_dual_input_power_supply; Verified date: 2006-04-05; Verified by: Lars Helge Mo; Status: Active; AN: A08-0543; MPN: SNT-100-BK-G; FootprintStatus: 'Active (Verified)'
R500 R501 R507 R508 = A02-0760: Thick film resistor, SMD 1210, 0.5W, 1%; PartGroup: Resistors,SMD,1210 1%; ComponentStatus: 'New (not verified)'; Status: Active; Verified by: Lars Helge Mo; Verified date: 2005-12-19; AN: A02-0760; Tolerance: 1%; FootprintStatus: 'Active (Verified)'
R502 = A02-0236: as R105 on sheet SAMC21N_Xplained_Pro_dual_input_power_supply; Status: Active; Verified by: Lars Helge Mo; Verified date: 2005-12-19; AN: A02-0236; Tolerance: 1 %; Height: 0.349999994039536; FootprintStatus: 'Active (Verified)'
R503 = A02-0212: as R104 on sheet SAMC21N_Xplained_Pro_dual_input_power_supply; Status: Active; Verified by: Lars Helge Mo; Verified date: 2005-12-19; AN: A02-0212; Tolerance: 1 %; Height: 0.349999994039536; FootprintStatus: 'Active (Verified)'
R504 = A02-0228: Thick film resistor, SMD 0402, 1/16W, 1%; PartGroup: Resistors,SMD,0402 1%; TemperatureRange: -55 - +125 deg C; ComponentStatus: 'Active (verified)'; Status: Active; Verified by: Lars Helge Mo; Verified date: 2005-12-19; AN: A02-0228; Tolerance: 1 %; Height: 0.349999994039536; FootprintStatus: 'Active (Verified)'
R505 = A02-0222: Thick film resistor, SMD 0402, 1/16W, 1%; PartGroup: Resistors,SMD,0402 1%; TemperatureRange: -55 - +125 deg C; ComponentStatus: 'Active (verified)'; Status: Active; Verified by: Lars Helge Mo; Verified date: 2005-12-19; AN: A02-0222; Tolerance: 1 %; Height: 0.349999994039536; FootprintStatus: 'Active (Verified)'
R506 = A02-0260: as R106 on sheet SAMC21N_Xplained_Pro_dual_input_power_supply; Status: Active; Verified by: Lars Helge Mo; Verified date: 2005-12-19; AN: A02-0260; Tolerance: 1 %; Height: 0,349999994039536; FootprintStatus: 'Active (Verified)'
SW500 = A08-0790: 6.2x6.2 mm SMD tact switch, same as A08-0091 but less force is needed; PartGroup: Mechanical devices,Switches,SMD; Manufacturer: ALPS; TemperatureRange: -30 - +90 deg C; ComponentStatus: 'Active (verified)'; Status: Active; Verified by: Ketil Skjerve; Verified date: 2006-03-15; AN: A08-0790; Height: 5,09999990463257; MPN: SKRAAKE010; FootprintStatus: 'Active (Verified)'
TP500 = A08-0004: Single SMD testpad; PartGroup: Mechanical devices,Connectors,Test points; ComponentStatus: 'Active (verified)'; Status: Active; Verified by: Sveinung Helgeland; Verified date: 2006-02-17; AN: A08-0004; Value: TESTPAD; Height: 0; FootprintStatus: 'Active (Verified)'
U500 U502 = A06-1172: 5Mbit/s CAN Trasceiver,VCC = 5V, VIO = 2.8-5V, 3x3 mm VDFN8; PartGroup: Integrated Circuits,Interface ICs,CAN; Manufacturer: ATMEL; ComponentStatus: 'Active (verified)'; Status: New; AN: A06-1172; Height: 0.899999976158142; MPN: ATA6561-GBQW; FootprintStatus: 'Active (Verified)'
U501 = A06-1194: LIN Transceiver; PartGroup: Integrated Circuits,Interface ICs,LIN; Manufacturer: ATMEL; ComponentStatus: 'New (not verified)'; AN: A06-1194; Height: 0.899999976158142; MPN: ATA663211-FAQW; FootprintStatus: 'Active (Verified)'

## Sheet SAMC21N_Xplained_Pro_Arduino_Connectors.SchDoc: Arduino Uno interface connectors
size A3; Organization: Microchip India; DocumentNumber: A09-2682; Revision: 4; SheetNumber: 9; SheetTotal: 9; CheckedBy: M.S.K; DrawnBy: Microchip India; PageSetup: Record=PageOptions|CenterHorizontal=True|CenterVertical=True|PrintScale=1.01|XCorrection=1.00|YCorrection=1.00|PrintKind=1|BorderSize=5000000|LeftOffset=0|BottomOffset=0|Orientation=2|PaperLength=1000|PaperWidth=1000|Scale=100|PaperSource=7|PrintQuality=-4|MediaType=1|DitherType=10|PaperKind=A3 (297 x 420 mm)|PrintScaleMode=1; ProjectTitle: ATSAMC21N-XPRO; PCBNumber: A08-2581; PCBRevision: 2
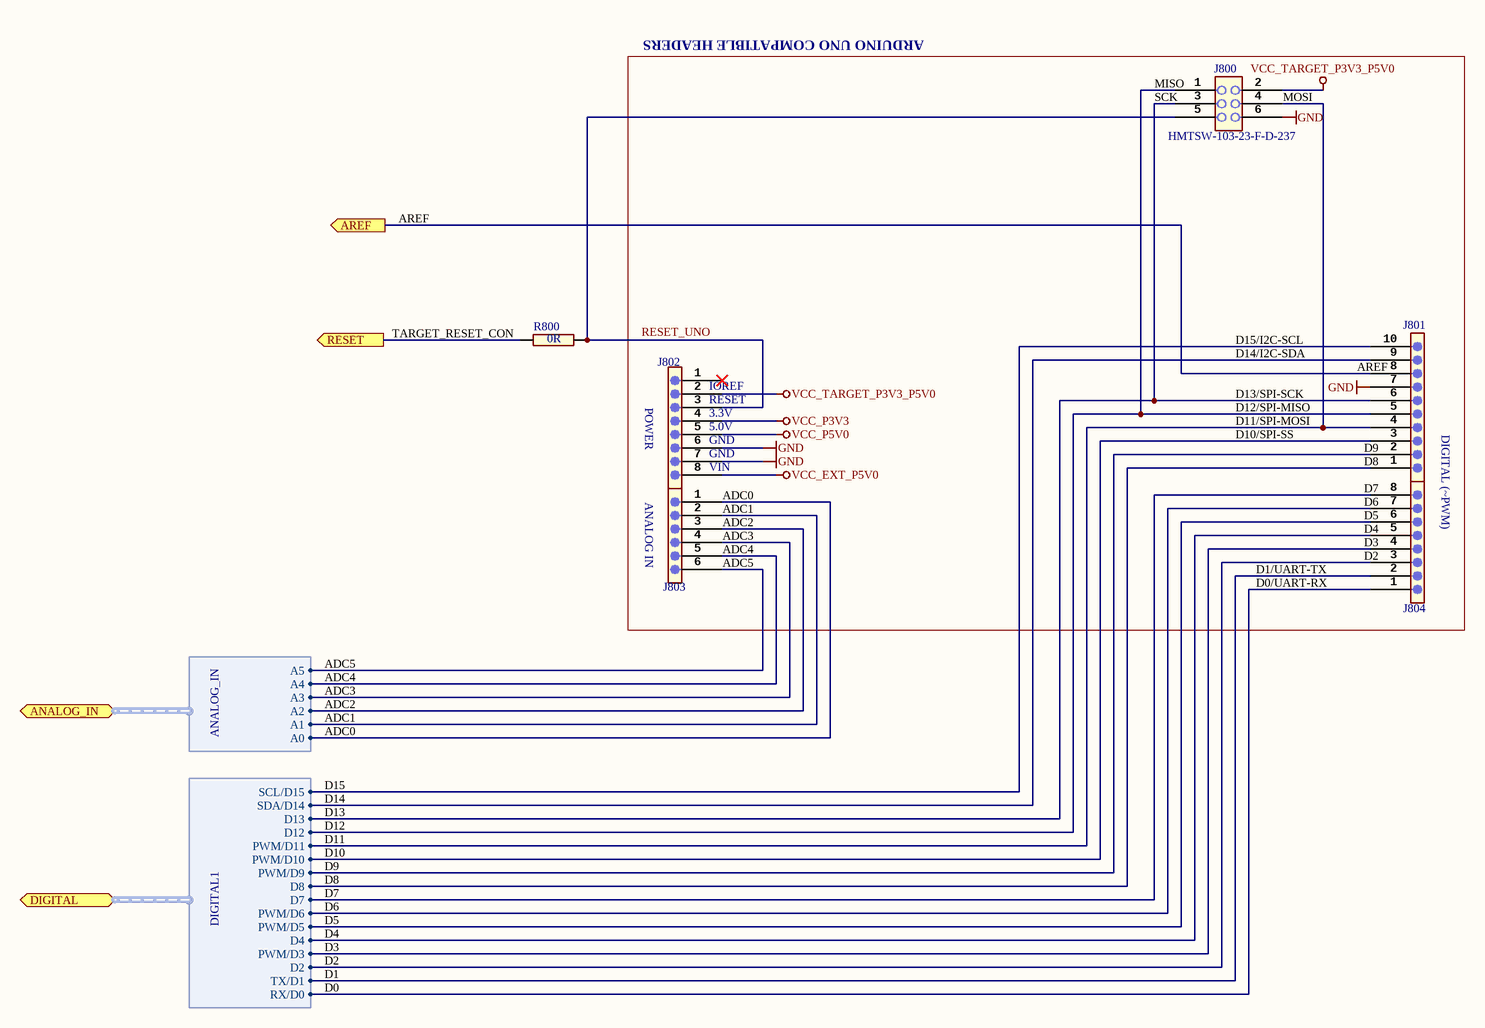
[diagram p6: SAMC21N_Xplained_Pro_Arduino_Connectors.SchDoc]

### Parts
J800  value HMTSW-103-23-F-D-237  [AP8-00182]  (hidden comment: HEADER 2x3)
J801  HEADER 1x10 FEMALE  [AP8-00822]  (value not drawn)
J802  HEADER 1x8 FEMALE  [AP8-00823]  (value not drawn)
J803  HEADER 1x6 FEMALE  [AP8-00824]  (value not drawn)
J804  HEADER 1x8 FEMALE  [AP8-00823]  (value not drawn)
R800  value 0R  [AP2-00000]  (hidden comment: R2)

### Ports
ANALOG_IN (harness ANALOG_IN), AREF (out), DIGITAL (harness DIGITAL1), RESET (out)

### Harnesses
ANALOG_IN: A0, A1, A2, A3, A4, A5
DIGITAL1: RX/D0, TX/D1, D2, PWM/D3, D4, PWM/D5, PWM/D6, D7, D8, PWM/D9, PWM/D10, PWM/D11, D12, D13, SDA/D14, SCL/D15

### Nets
GND: J800.6 J801.7 J802.6 J802.7
VCC_EXT_P5V0: J802.8
VCC_P3V3: J802.4
VCC_P5V0: J802.5
VCC_TARGET_P3V3_P5V0: J800.2 J802.2
PA03_ADC_DAC_VREF: J801.8 ; port AREF
PA14_PWM_TC3_WO0: J804.4 ; port DIGITAL.PWM/D3
PA15_PWM_TC3_WO1: J804.6 ; port DIGITAL.PWM/D5
PA16_S1_I2C_SDA: J801.9 ; port DIGITAL.SDA/D14
PA17_S1_I2C_SCL: J801.10 ; port DIGITAL.SCL/D15
PB04_GPIO: J804.8 ; port DIGITAL.D7
PB08_INN1_Y14: J803.2 ; port ANALOG_IN.A1
PB09_INP1_Y15: J803.1 ; port ANALOG_IN.A0
PB18_GPIO_S7_SPI_SS: J801.3 ; port DIGITAL.PWM/D10
PB24_S0_UART_TX: J804.2 ; port DIGITAL.TX/D1
PB25_S0_UART_RX: J804.1 ; port DIGITAL.RX/D0
PB30_PWM_TC0_WO0: J804.7 ; port DIGITAL.PWM/D6
PB31_PWM_TC0_WO1: J801.2 ; port DIGITAL.PWM/D9
PC00_ADC0_AIN8: J803.3 ; port ANALOG_IN.A2
PC01_ADC0_AIN9: J803.4 ; port ANALOG_IN.A3
PC02_ADC0_AIN10: J803.5 ; port ANALOG_IN.A4
PC03_ADC0_AIN11: J803.6 ; port ANALOG_IN.A5
PC11_S7_SPI_SCK: J800.3 J801.6 ; port DIGITAL.D13
PC12_S7_SPI_MISO: J800.1 J801.5 ; port DIGITAL.D12
PC14_S7_SPI_MOSI: J800.4 J801.4 ; port DIGITAL.PWM/D11
PC20_GPIO: J804.3 ; port DIGITAL.D2
PC21_GPIO: J804.5 ; port DIGITAL.D4
PC26_GPIO: J801.1 ; port DIGITAL.D8
RESET_UNO: J800.5 J802.3 R800.2
TARGET_RESET_CON: R800.1 ; port RESET

Not connected (* = marked no-connect by the designer): J802 1*

### Notes on the sheet
- ARDUINO UNO COMPATIBLE HEADERS
- (near J800) MISO
- (near J800) SCK
- (near J800) MOSI
- AREF
- (near R800) TARGET_RESET_CON
- D14/I2C-SDA
- D15/I2C-SCL
- (near J801) AREF
- (near J802) POWER
- (near J802) IOREF
- (near J802) RESET
- (near J802) 3.3V
- (near J802) 5.0V
- (near J802) GND
- D10/SPI-SS
- D11/SPI-MOSI
- D12/SPI-MISO
- D13/SPI-SCK
- D9
- DIGITAL (~PWM)
- ANALOG IN
- VIN
- ADC0
- ADC1
- D6
- D7
- D8
- ADC2
- (near J803) ADC3
- (near J803) ADC4
- (near J803) ADC5
- D0/UART-RX
- D1/UART-TX
- (near J804) D2
- (near J804) D3
- (near J804) D4
- D5
- ADC3
- ADC4
- ADC5
- D10
- D11
- D12
- D13
- D14
- D15
- D0
- D1
- D2
- D3
- D4
- Drawn By:
- Project Title
- Engineer:
- Designed with
- Sheet Title
- Size
- A3
- PCB Number:
- PCB Assembly Number:
- PCBA Revision:
- PCB    Revision:
- Date:
- Altium.com <http://go.altium.com/MicrochipLandingPage_Evaluation.html>
- File:
- Page:

### Library data of the parts
J800 = A08-1654: 2x3 pin header, 2.54mm pitch, Pin-in-Paste THM; PartGroup: Mechanical devices,Connectors,Pin headers; Manufacturer: SAMTEC; TemperatureRange: - 55 ï¿½C to + 125 ï¿½C; ComponentStatus: 'Active (verified)'; Status: Active; Verified by: Lars Helge Mo; Verified date: 2005-12-15; AN: A08-1654; Height: 6,09999990463257; MPN: HMTSW-103-23-F-D-237; FootprintStatus: 'Active (Verified)'
J801 = A08-2026: 1x10 receptacle pin header, low insertion force, 2.54mm pitch THM, Pin in Paste; PartGroup: Mechanical devices,Connectors,Pin header receptacle; Manufacturer: SAMTEC; Value: SSQ-110-21-F-S; ComponentStatus: 'New (not verified)'; Status: New; AN: A08-2026; Height: 8,51000022888184; MPN: SSQ-110-21-F-S; FootprintStatus: 'New (Not verified)'
J802 J804 = A08-2025: 1x8 receptacle pin header, low insertion force, 2.54mm pitch THM, Pin in Paste; PartGroup: Mechanical devices,Connectors,Pin header receptacle; Manufacturer: SAMTEC; Value: SSQ-108-21-F-S; ComponentStatus: 'New (not verified)'; Status: New; AN: A08-2025; Height: 8,51000022888184; MPN: SSQ-108-21-F-S; FootprintStatus: 'New (Not verified)'
J803 = A08-2024: 1x6 receptacle pin header, low insertion force, 2.54mm pitch THM; PartGroup: Mechanical devices,Connectors,Pin header receptacle; Manufacturer: SAMTEC; Value: SSQ-106-21-F-S; ComponentStatus: 'New (not verified)'; Status: Active; Verified date: 2006-02-15; Verified by: Ketil Skjerve; AN: A08-2024; Height: 8,51000022888184; MPN: SSQ-106-21-F-S; FootprintStatus: 'New (Not verified)'
R800 = A02-0163: RES 0.0 OHM 1/16W 0402 SMD; PartGroup: Resistors,SMD,0402 1%; Manufacturer: (n/a); MPN: RMCF0402ZT0R00; Tolerance: 1 %; TemperatureRange: -55 - +125 deg C; ComponentStatus: 'Active (verified)'; Status: Active; Verified by: Lars Helge Mo; Verified date: 2005-12-19; AN: A02-0163; Height: 0.349999994039536; FootprintStatus: 'Active (Verified)'

## Sheet SAMC21N_Xplained_Pro_Level_Converters.SchDoc: Data Level Converters
size A3; Organization: Microchip India; DocumentNumber: A09-2682; Revision: 4; SheetNumber: 7; SheetTotal: 9; CheckedBy: M.S.K; DrawnBy: Microchip India; PageSetup: Record=PageOptions|CenterHorizontal=True|CenterVertical=True|PrintScale=0.71|XCorrection=1.00|YCorrection=1.00|PrintKind=0|BorderSize=5000000|LeftOffset=0|BottomOffset=0|Orientation=2|PaperLength=1000|PaperWidth=1000|Scale=100|PaperSource=15|PrintQuality=600|MediaType=1|DitherType=10|PrintScaleMode=1|PaperKind=A4 (210 x 297 mm)|PaperIndex=9; ProjectTitle: ATSAMC21N-XPRO; PCBNumber: A08-2581; PCBRevision: 2
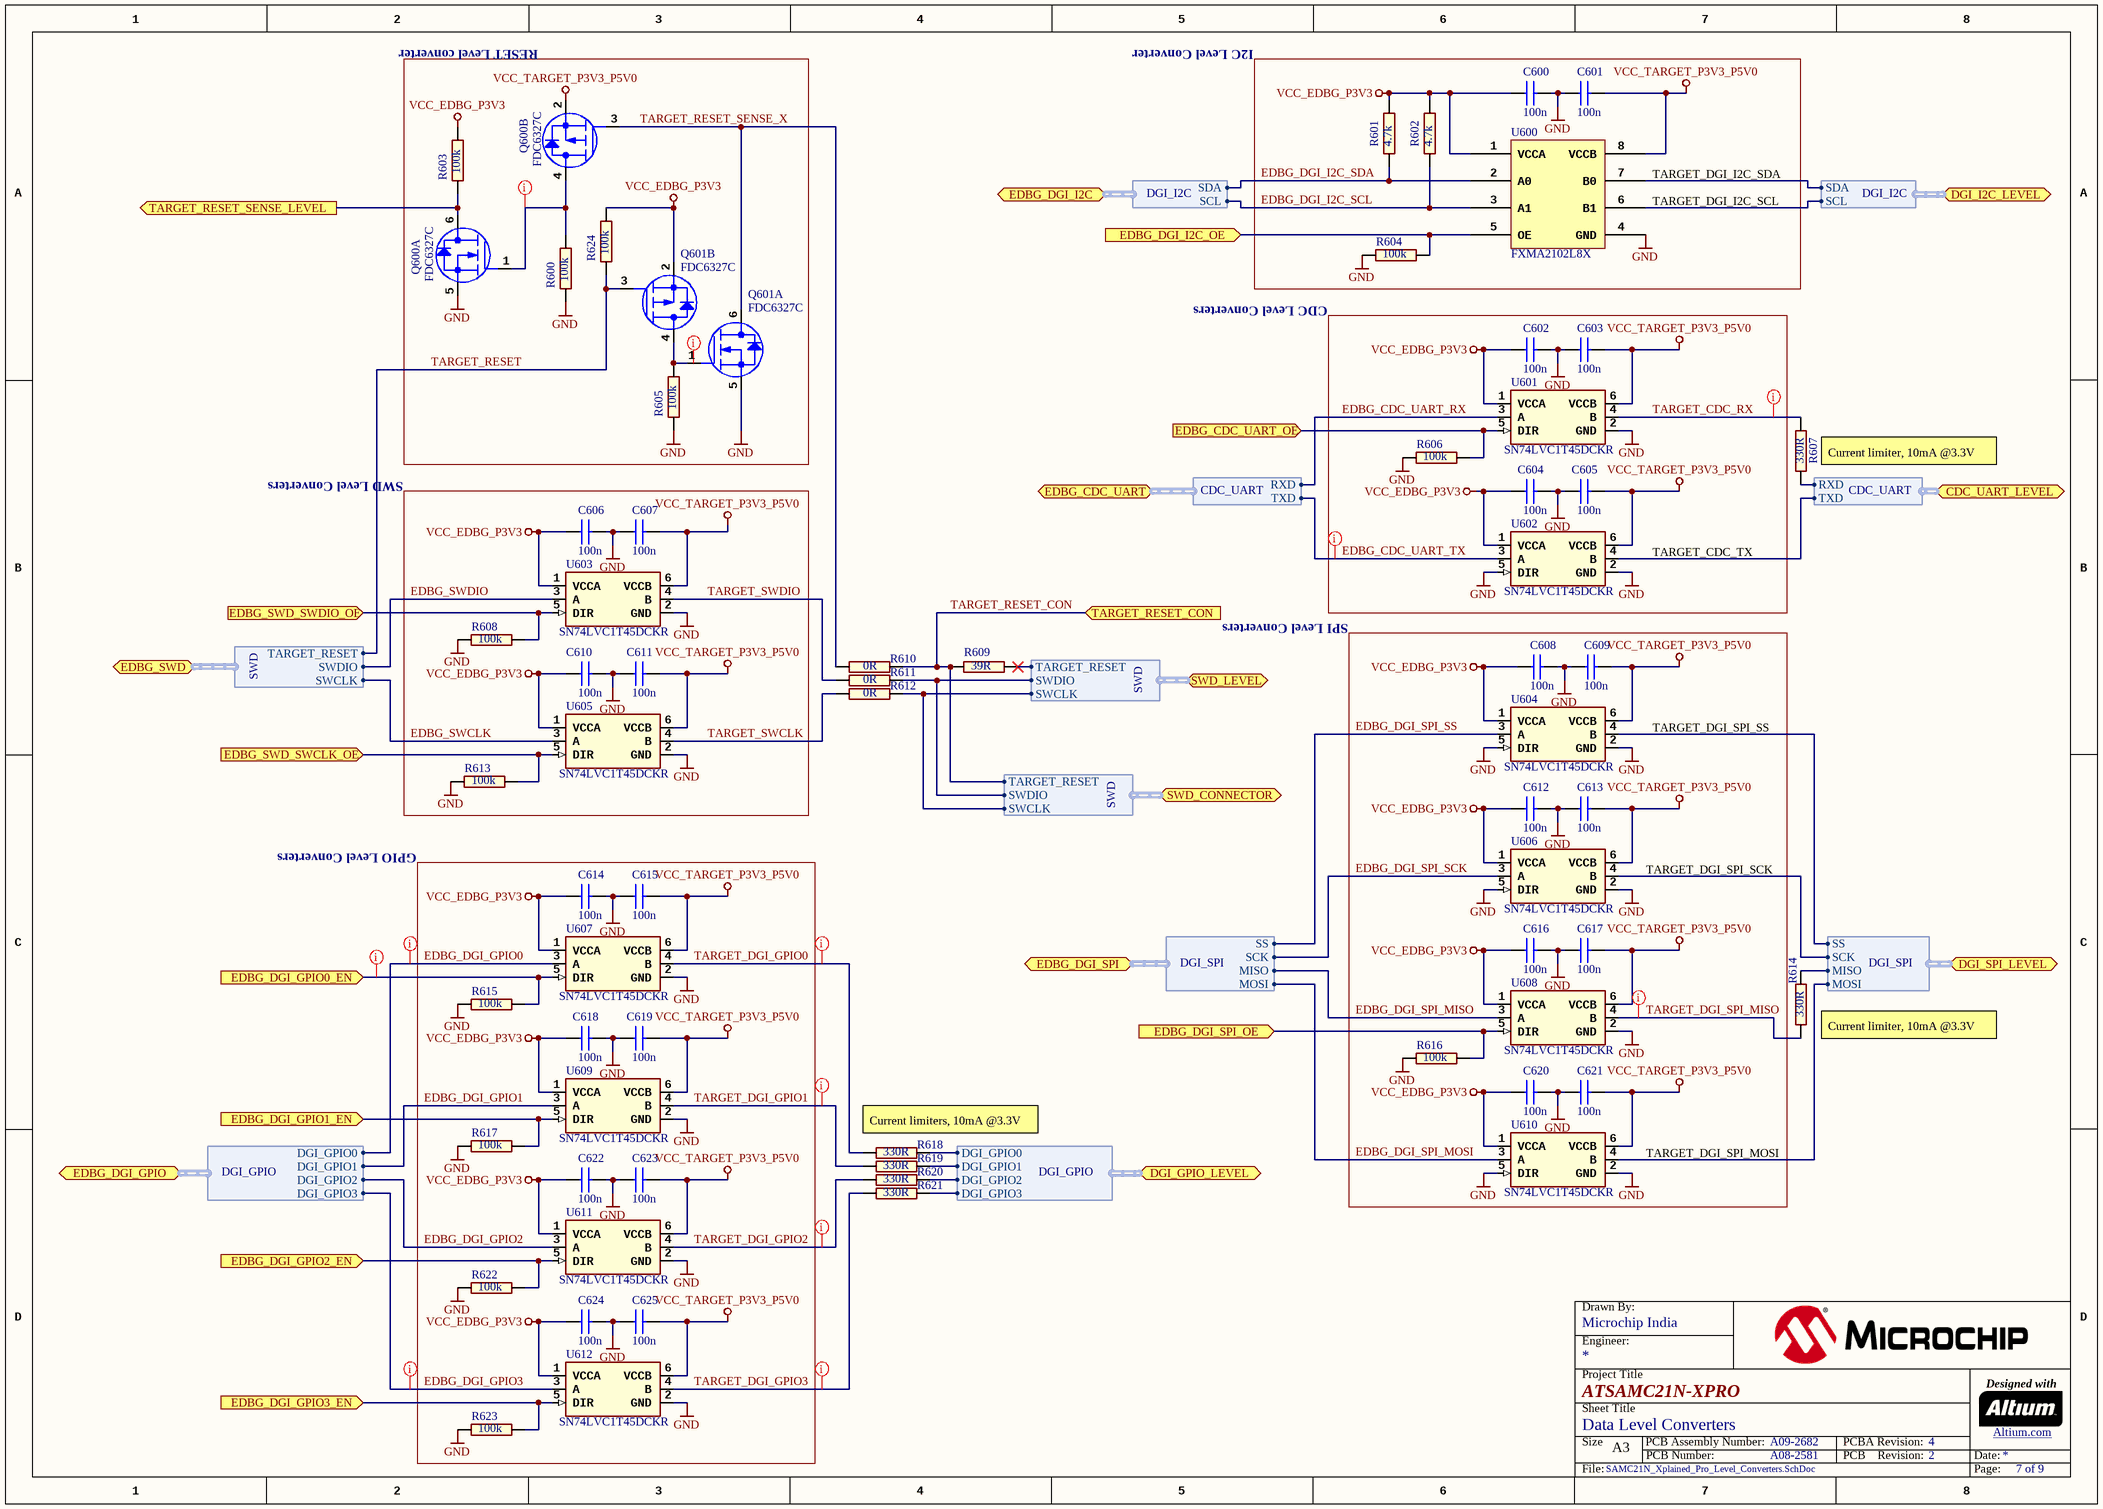
[diagram p7: SAMC21N_Xplained_Pro_Level_Converters.SchDoc]

### Parts
C600  value 100n  [AP1-00053]  (hidden comment: CAP-NONPOL)
C601  value 100n  [AP1-00053]  (hidden comment: CAP-NONPOL)
C602  value 100n  [AP1-00053]  (hidden comment: CAP-NONPOL)
C603  value 100n  [AP1-00053]  (hidden comment: CAP-NONPOL)
C604  value 100n  [AP1-00053]  (hidden comment: CAP-NONPOL)
C605  value 100n  [AP1-00053]  (hidden comment: CAP-NONPOL)
C606  value 100n  [AP1-00053]  (hidden comment: CAP-NONPOL)
C607  value 100n  [AP1-00053]  (hidden comment: CAP-NONPOL)
C608  value 100n  [AP1-00053]  (hidden comment: CAP-NONPOL)
C609  value 100n  [AP1-00053]  (hidden comment: CAP-NONPOL)
C610  value 100n  [AP1-00053]  (hidden comment: CAP-NONPOL)
C611  value 100n  [AP1-00053]  (hidden comment: CAP-NONPOL)
C612  value 100n  [AP1-00053]  (hidden comment: CAP-NONPOL)
C613  value 100n  [AP1-00053]  (hidden comment: CAP-NONPOL)
C614  value 100n  [AP1-00053]  (hidden comment: CAP-NONPOL)
C615  value 100n  [AP1-00053]  (hidden comment: CAP-NONPOL)
C616  value 100n  [AP1-00053]  (hidden comment: CAP-NONPOL)
C617  value 100n  [AP1-00053]  (hidden comment: CAP-NONPOL)
C618  value 100n  [AP1-00053]  (hidden comment: CAP-NONPOL)
C619  value 100n  [AP1-00053]  (hidden comment: CAP-NONPOL)
C620  value 100n  [AP1-00053]  (hidden comment: CAP-NONPOL)
C621  value 100n  [AP1-00053]  (hidden comment: CAP-NONPOL)
C622  value 100n  [AP1-00053]  (hidden comment: CAP-NONPOL)
C623  value 100n  [AP1-00053]  (hidden comment: CAP-NONPOL)
C624  value 100n  [AP1-00053]  (hidden comment: CAP-NONPOL)
C625  value 100n  [AP1-00053]  (hidden comment: CAP-NONPOL)
Q600  value FDC6327C  [AP5-00008]  (hidden comment: Farnell no: 9844856)  (parts A,B of 2)
Q601  value FDC6327C  [AP5-00008]  (hidden comment: Farnell no: 9844856)  (parts A,B of 2)
R600  value 100k  [AP2-00011]  (hidden comment: R2)
R601  value 4.7k  [AP2-00011]  (hidden comment: R2)
R602  value 4.7k  [AP2-00011]  (hidden comment: R2)
R603  value 100k  [AP2-00011]  (hidden comment: R2)
R604  value 100k  [AP2-00011]  (hidden comment: R2)
R605  value 100k  [AP2-00011]  (hidden comment: R2)
R606  value 100k  [AP2-00011]  (hidden comment: R2)
R607  value 330R  [AP2-00011]  (hidden comment: R2)
R608  value 100k  [AP2-00011]  (hidden comment: R2)
R609  value 39R  [AP2-00011]  (hidden comment: R2)
R610  value 0R  [AP2-00000]  (hidden comment: R2)
R611  value 0R  [AP2-00000]  (hidden comment: R2)
R612  value 0R  [AP2-00000]  (hidden comment: R2)
R613  value 100k  [AP2-00011]  (hidden comment: R2)
R614  value 330R  [AP2-00011]  (hidden comment: R2)
R615  value 100k  [AP2-00011]  (hidden comment: R2)
R616  value 100k  [AP2-00011]  (hidden comment: R2)
R617  value 100k  [AP2-00011]  (hidden comment: R2)
R618  value 330R  [AP2-00011]  (hidden comment: R2)
R619  value 330R  [AP2-00011]  (hidden comment: R2)
R620  value 330R  [AP2-00011]  (hidden comment: R2)
R621  value 330R  [AP2-00011]  (hidden comment: R2)
R622  value 100k  [AP2-00011]  (hidden comment: R2)
R623  value 100k  [AP2-00011]  (hidden comment: R2)
R624  value 100k  [AP2-00011]  (hidden comment: R2)
U600  value FXMA2102L8X  [AP6-00258]  (hidden comment: FXMA2102)
U601  SN74LVC1T45DCKR  [AP6-00015]
U602  SN74LVC1T45DCKR  [AP6-00015]
U603  SN74LVC1T45DCKR  [AP6-00015]
U604  SN74LVC1T45DCKR  [AP6-00015]
U605  SN74LVC1T45DCKR  [AP6-00015]
U606  SN74LVC1T45DCKR  [AP6-00015]
U607  SN74LVC1T45DCKR  [AP6-00015]
U608  SN74LVC1T45DCKR  [AP6-00015]
U609  SN74LVC1T45DCKR  [AP6-00015]
U610  SN74LVC1T45DCKR  [AP6-00015]
U611  SN74LVC1T45DCKR  [AP6-00015]
U612  SN74LVC1T45DCKR  [AP6-00015]

### Blocks framed on the sheet
RESET Level converter: Q600 Q601 R600 R603 R605 R624
I2C Level Converter: C600 C601 R601 R602 R604 U600
CDC Level Converters: C602-C605 R606 U601 U602
SWD Level Converters: C606 C607 C610 C611 R608 R613 U603 U605
SPI Level Converters: C608 C609 C612 C613 C616 C617 C620 C621 R616 U604 U606 U608 U610
GPIO Level Converters: C614 C615 C618 C619 C622-C625 R615 R617 R622 R623 U607 U609 U611 U612

### Ports
CDC_UART_LEVEL (harness CDC_UART), DGI_GPIO_LEVEL (harness DGI_GPIO), DGI_I2C_LEVEL (harness DGI_I2C), DGI_SPI_LEVEL (harness DGI_SPI), EDBG_CDC_UART (harness CDC_UART), EDBG_CDC_UART_OE (in), EDBG_DGI_GPIO0_EN (in), EDBG_DGI_GPIO1_EN (in), EDBG_DGI_GPIO2_EN (in), EDBG_DGI_GPIO3_EN (in), EDBG_DGI_GPIO (harness DGI_GPIO), EDBG_DGI_I2C (harness DGI_I2C), EDBG_DGI_I2C_OE (in), EDBG_DGI_SPI (harness DGI_SPI), EDBG_DGI_SPI_OE (in), EDBG_SWD (harness SWD), EDBG_SWD_SWCLK_OE (in), EDBG_SWD_SWDIO_OE (in), SWD_CONNECTOR (harness SWD), SWD_LEVEL (harness SWD), TARGET_RESET_CON (in), TARGET_RESET_SENSE_LEVEL (out)

### Harnesses
DGI_GPIO: DGI_GPIO0, DGI_GPIO1, DGI_GPIO2, DGI_GPIO3
DGI_SPI: MISO, MOSI, SCK, SS
DGI_I2C: SCL, SDA
CDC_UART: RXD, TXD
SWD: SWCLK, SWDIO, TARGET_RESET

### Nets
GND: C600.2 C601.1 C602.2 C603.1 C604.2 C605.1 C606.2 C607.1 C608.2 C609.1 C610.2 C611.1 C612.2 C613.1 C614.2 C615.1 C616.2 C617.1 C618.2 C619.1 C620.2 C621.1 C622.2 C623.1 C624.2 C625.1 Q600.5(S) Q601.5(S) R600.1 R604.1 R605.1 R606.2 R608.2 R613.2 R615.2 R616.2 R617.2 R622.2 R623.2 U600.4(GND) U601.2(GND) U602.2(GND) U602.5(DIR) U603.2(GND) U604.2(GND) U604.5(DIR) U605.2(GND) U606.2(GND) U606.5(DIR) U607.2(GND) U608.2(GND) U609.2(GND) U610.2(GND) U610.5(DIR) U611.2(GND) U612.2(GND)
VCC_EDBG_P3V3: C600.1 C602.1 C604.1 C606.1 C608.1 C610.1 C612.1 C614.1 C616.1 C618.1 C620.1 C622.1 C624.1 Q601.2(S) R601.2 R602.2 R603.2 R624.2 U600.1(VCCA) U601.1(VCCA) U602.1(VCCA) U603.1(VCCA) U604.1(VCCA) U605.1(VCCA) U606.1(VCCA) U607.1(VCCA) U608.1(VCCA) U609.1(VCCA) U610.1(VCCA) U611.1(VCCA) U612.1(VCCA)
VCC_TARGET_P3V3_P5V0: C601.2 C603.2 C605.2 C607.2 C609.2 C611.2 C613.2 C615.2 C617.2 C619.2 C621.2 C623.2 C625.2 Q600.2(S) U600.8(VCCB) U601.6(VCCB) U602.6(VCCB) U603.6(VCCB) U604.6(VCCB) U605.6(VCCB) U606.6(VCCB) U607.6(VCCB) U608.6(VCCB) U609.6(VCCB) U610.6(VCCB) U611.6(VCCB) U612.6(VCCB)
EDBG_CDC_UART_OE: R606.1 U601.5(DIR) ; port EDBG_CDC_UART_OE
EDBG_CDC_UART_RX: U601.3(A) ; port EDBG_CDC_UART.RXD
EDBG_CDC_UART_TX: U602.3(A) ; port EDBG_CDC_UART.TXD
EDBG_DGI_GPIO0: U607.3(A) ; port EDBG_DGI_GPIO.DGI_GPIO0
EDBG_DGI_GPIO0_EN: R615.1 U607.5(DIR) ; port EDBG_DGI_GPIO0_EN
EDBG_DGI_GPIO1: U609.3(A) ; port EDBG_DGI_GPIO.DGI_GPIO1
EDBG_DGI_GPIO1_EN: R617.1 U609.5(DIR) ; port EDBG_DGI_GPIO1_EN
EDBG_DGI_GPIO2: U611.3(A) ; port EDBG_DGI_GPIO.DGI_GPIO2
EDBG_DGI_GPIO2_EN: R622.1 U611.5(DIR) ; port EDBG_DGI_GPIO2_EN
EDBG_DGI_GPIO3: U612.3(A) ; port EDBG_DGI_GPIO.DGI_GPIO3
EDBG_DGI_GPIO3_EN: R623.1 U612.5(DIR) ; port EDBG_DGI_GPIO3_EN
EDBG_DGI_I2C_OE: R604.2 U600.5(OE) ; port EDBG_DGI_I2C_OE
EDBG_DGI_I2C_SCL: R602.1 U600.3(A1) ; port EDBG_DGI_I2C.SCL
EDBG_DGI_I2C_SDA: R601.1 U600.2(A0) ; port EDBG_DGI_I2C.SDA
EDBG_DGI_SPI_MISO: U608.3(A) ; port EDBG_DGI_SPI.MISO
EDBG_DGI_SPI_MOSI: U610.3(A) ; port EDBG_DGI_SPI.MOSI
EDBG_DGI_SPI_OE: R616.1 U608.5(DIR) ; port EDBG_DGI_SPI_OE
EDBG_DGI_SPI_SCK: U606.3(A) ; port EDBG_DGI_SPI.SCK
EDBG_DGI_SPI_SS: U604.3(A) ; port EDBG_DGI_SPI.SS
EDBG_SWCLK: U605.3(A) ; port EDBG_SWD.SWCLK
EDBG_SWD_SWCLK_OE: R613.1 U605.5(DIR) ; port EDBG_SWD_SWCLK_OE
EDBG_SWD_SWDIO_OE: R608.1 U603.5(DIR) ; port EDBG_SWD_SWDIO_OE
EDBG_SWDIO: U603.3(A) ; port EDBG_SWD.SWDIO
PA16_S1_I2C_SDA: U600.7(B0) ; port DGI_I2C_LEVEL.SDA
PA17_S1_I2C_SCL: U600.6(B1) ; port DGI_I2C_LEVEL.SCL
PA22_IRQ6_X10_Y26: R619.2 ; port DGI_GPIO_LEVEL.DGI_GPIO1
PA28_GPIO_IRQ8: R621.2 ; port DGI_GPIO_LEVEL.DGI_GPIO3
PA30_SWCLK: R612.2 ; port SWD_LEVEL.SWCLK, port SWD_CONNECTOR.SWCLK
PA31_SWDIO: R611.2 ; port SWD_LEVEL.SWDIO, port SWD_CONNECTOR.SWDIO
PB10_S4_CDC_TX: U602.4(B) ; port CDC_UART_LEVEL.TXD
PB11_S4_CDC_RX: R607.1 ; port CDC_UART_LEVEL.RXD
PB12_TC4_WO0_X12_Y28: R618.2 ; port DGI_GPIO_LEVEL.DGI_GPIO0
PC09_SPI_S7_SS: U604.4(B) ; port DGI_SPI_LEVEL.SS
PC11_S7_SPI_SCK: U606.4(B) ; port DGI_SPI_LEVEL.SCK
PC12_S7_SPI_MISO: R614.2 ; port DGI_SPI_LEVEL.MISO
PC14_S7_SPI_MOSI: U610.4(B) ; port DGI_SPI_LEVEL.MOSI
PC24_GPIO_IRQ0: R620.2 ; port DGI_GPIO_LEVEL.DGI_GPIO2
TARGET_CDC_RX: R607.2 U601.4(B)
TARGET_DGI_GPIO0: R618.1 U607.4(B)
TARGET_DGI_GPIO1: R619.1 U609.4(B)
TARGET_DGI_GPIO2: R620.1 U611.4(B)
TARGET_DGI_GPIO3: R621.1 U612.4(B)
TARGET_DGI_SPI_MISO: R614.1 U608.4(B)
TARGET_RESET: Q601.3(G) R624.1 ; port EDBG_SWD.TARGET_RESET
TARGET_RESET_CON: R609.1 R610.2 ; port TARGET_RESET_CON, port SWD_CONNECTOR.TARGET_RESET
TARGET_RESET_SENSE: R609.2 ; port SWD_LEVEL.TARGET_RESET
TARGET_RESET_SENSE_LEVEL: Q600.6(D) R603.1 ; port TARGET_RESET_SENSE_LEVEL
TARGET_RESET_SENSE_X: Q600.3(G) Q601.6(D) R610.1
TARGET_SWCLK: R612.1 U605.4(B)
TARGET_SWDIO: R611.1 U603.4(B)
NetQ600_1: Q600.1(G) Q600.4(D) R600.2
NetQ601_1: Q601.1(G) Q601.4(D) R605.2

### Layout directives
rule Assembly Testpoint Usage [Testpoint - Not Allowed    Multiple - Not Allowed]: (no net found under the mark), EDBG_CDC_UART_TX, EDBG_DGI_GPIO0, EDBG_DGI_GPIO0_EN, EDBG_DGI_GPIO3, NetQ600_1, TARGET_CDC_RX, TARGET_DGI_GPIO0, TARGET_DGI_GPIO1, TARGET_DGI_GPIO2, TARGET_DGI_GPIO3, TARGET_DGI_SPI_MISO

### Notes on the sheet
- (near U600) TARGET_DGI_I2C_SDA
- (near U600) TARGET_DGI_I2C_SCL
- (near R607) Current limiter, 10mA @3.3V
- (near U602) TARGET_CDC_TX
- (near U604) TARGET_DGI_SPI_SS
- (near U606) TARGET_DGI_SPI_SCK
- (near R614) Current limiter, 10mA @3.3V
- Current limiters, 10mA @3.3V
- (near U610) TARGET_DGI_SPI_MOSI
- Drawn By:
- Project Title
- Engineer:
- Designed with
- Sheet Title
- Size
- A3
- PCB Number:
- PCB Assembly Number:
- PCBA Revision:
- PCB    Revision:
- Date:
- Altium.com <http://go.altium.com/MicrochipLandingPage_Evaluation.html>
- File:
- Page:

### Library data of the parts
C600-C625 = A01-0246: as C102 on sheet SAMC21N_Xplained_Pro_dual_input_power_supply; Status: Active; Verified by: Lars Helge Mo; Verified date: 2005-12-15; AN: A01-0246; Tolerance: 16V, +/-10%; Height: 0,5; FootprintStatus: 'Active (Verified)'
Q600 Q601 = A05-0040: Dual N/P-ch MOSFET, 20V, 2.7A/-1.9A cont, 8A/-8A pulse, RDS(ON)<0.08/0.17Ohm@VGS=4.5V, VGS(th)<1.5/-1.5V, SSOT6; PartGroup: Transistors,Power FET,SMD; Manufacturer: Fairchild; TemperatureRange: -55 - +150 deg C; ComponentStatus: 'Active (verified)'; Status: New; AN: A05-0040; Height: 1.10000002384186; MPN: FDC6327C; FootprintStatus: 'Active (Verified)'
R600 R603-R606 R608 R613 R615-R617 R622-R624 = A02-0260: as R106 on sheet SAMC21N_Xplained_Pro_dual_input_power_supply; Status: Active; Verified by: Lars Helge Mo; Verified date: 2005-12-19; AN: A02-0260; Tolerance: 1 %; Height: 0,349999994039536; FootprintStatus: 'Active (Verified)'
R601 R602 = A02-0228: Thick film resistor, SMD 0402, 1/16W, 1%; PartGroup: Resistors,SMD,0402 1%; TemperatureRange: -55ï¿½ to +125ï¿½C; ComponentStatus: 'Active (verified)'; Status: Active; Verified by: Lars Helge Mo; Verified date: 2005-12-19; AN: A02-0228; Tolerance: 1 %; Height: 0.349999994039536; FootprintStatus: 'Active (Verified)'
R607 R614 R618-R621 = A02-0200: Thick film resistor, SMD 0402, 1/16W, 1%; PartGroup: Resistors,SMD,0402 1%; TemperatureRange: -55 - +125 deg C; ComponentStatus: 'Active (verified)'; Status: Active; Verified by: Lars Helge Mo; Verified date: 2005-12-19; AN: A02-0200; Tolerance: 1 %; Height: 0,349999994039536; FootprintStatus: 'Active (Verified)'
R609 = A02-0178: Thick film resistor, SMD 0402, 1/16W, 1%; PartGroup: Resistors,SMD,0402 1%; TemperatureRange: -55 - +125 deg C; ComponentStatus: 'Active (verified)'; Status: Active; Verified by: Lars Helge Mo; Verified date: 2005-12-19; AN: A02-0178; Tolerance: 1 %; Height: 0,349999994039536; FootprintStatus: 'Active (Verified)'
R610-R612 = A02-0163: Thick film resistor, SMD 0402, 1/16W, 1%; PartGroup: Resistors,SMD,0402 1%; TemperatureRange: -55 - +125 deg C; ComponentStatus: 'Active (verified)'; Status: Active; Verified by: Lars Helge Mo; Verified date: 2005-12-19; AN: A02-0163; Tolerance: 1 %; Height: 0.349999994039536; FootprintStatus: 'Active (Verified)'
U600 = A06-0714: Dual supply, 2-bit, voltage translator, buffer, repeater, isolator for I2C applications; PartGroup: Integrated Circuits,Interface ICs,I2C; Manufacturer: Fairchild; TemperatureRange: -40 - +85 deg C; ComponentStatus: 'Active (verified)'; AN: A06-0714; Height: 0.550000011920929; MPN: FXMA2102L8X; FootprintStatus: 'Active (Verified)'
U601-U612 = A06-1038: Single-Bit Dual-Supply Bus Transceiver with Configurable Voltage Translation and 3-State Outputs; PartGroup: Integrated Circuits,Interface ICs,Level translators; Manufacturer: Texas Instruments; TemperatureRange: –40 - 85 °C; ComponentStatus: 'Active (verified)'; Status: Verified; Verified date: 29.08.2013; Verified by: Sveinung Helgeland; AN: A06-1038; Value: SN74LVC1T45DCKR; Height: 1.10000002384186; MPN: SN74LVC1T45DCKR; FootprintStatus: 'Active (Verified)'